# Altium project SuperClock_Core.PrjPcb
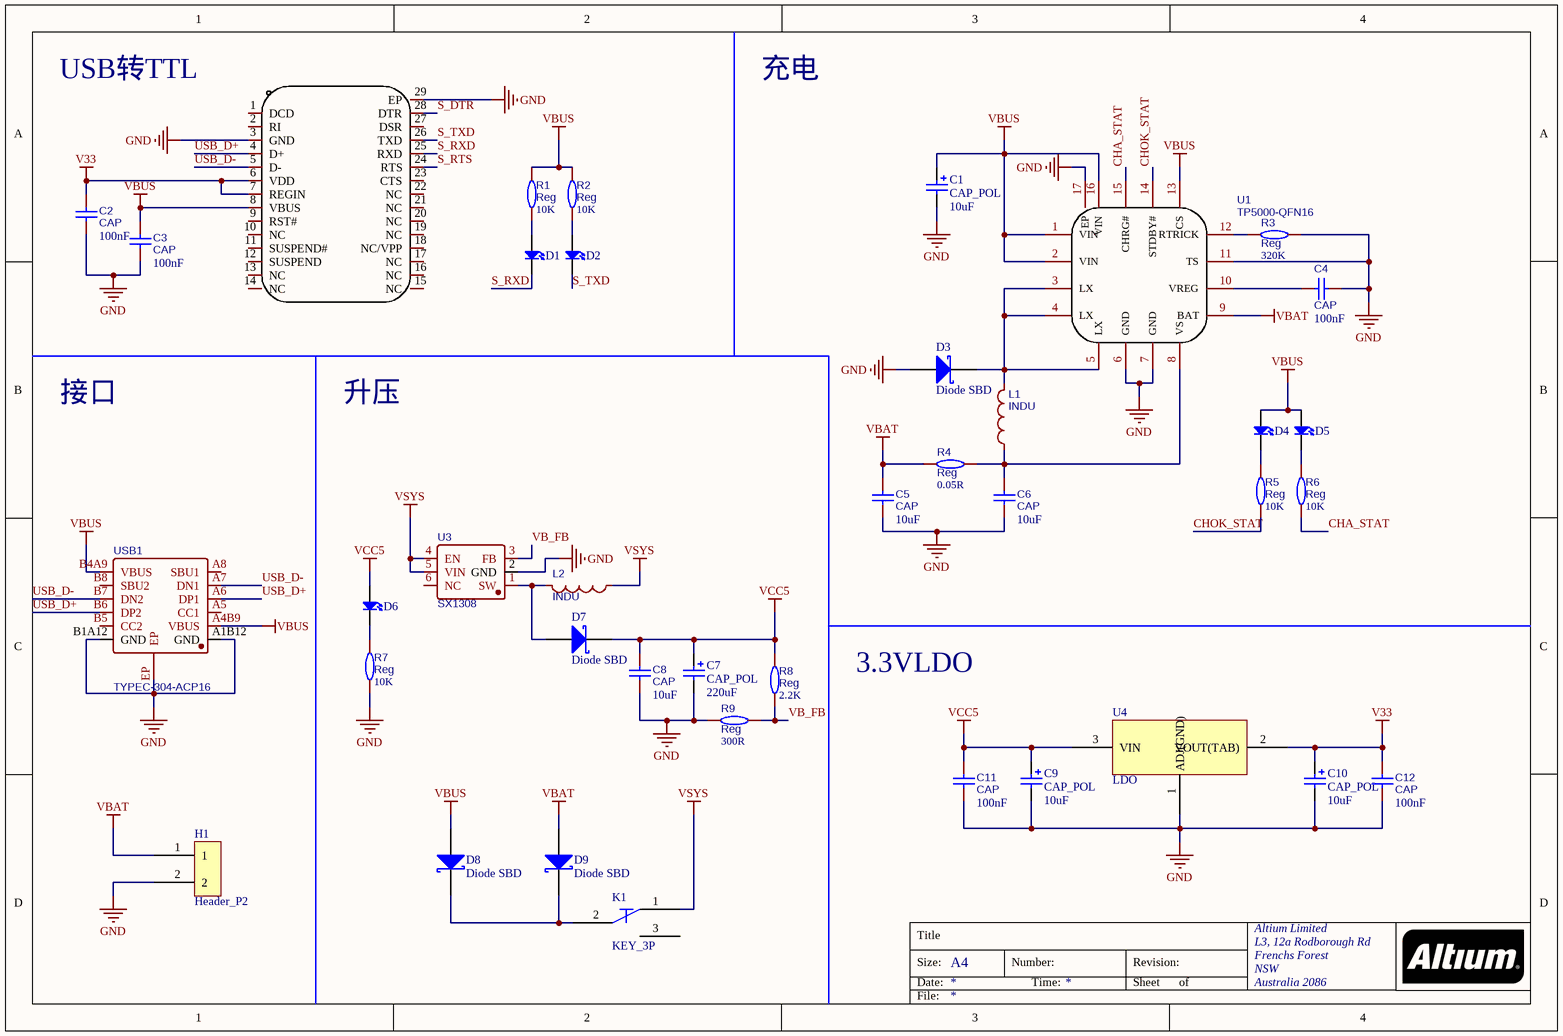
[diagram p0: SuperClock_Core_PWR.SchDoc]
2 sheets, 85 parts. Net scope: global (net labels, ports and power ports of the same name join across sheets).
Board files: SuperClock_Core.PcbDoc, SuperClock_Core_backup.PcbDoc
Sheets:
  SuperClock_Core_PWR.SchDoc
  SuperClock_Core_WIFI.SchDoc

## Sheet SuperClock_Core_PWR.SchDoc
size A4; Organization: Altium Limited; Address1: L3, 12a Rodborough Rd; Address2: Frenchs Forest; Address3: NSW; Address4: Australia 2086

### Parts
C1  CAP_POL  value 10uF  [CP1210]
C2  CAP  value 100nF  [C0603]
C3  CAP  value 100nF  [C0603]
C4  CAP  value 100nF  [C0603]
C5  CAP  value 10uF  [C0603]
C6  CAP  value 10uF  [C0603]
C7  CAP_POL  value 220uF  [CAP_SMD_6.3mm]
C8  CAP  value 10uF  [C0603]
C9  CAP_POL  value 10uF  [CP1210]
C10  CAP_POL  value 10uF  [CP1210]
C11  CAP  value 100nF  [C0603]
C12  CAP  value 100nF  [C0603]
D1  LED  [LED0603]  (value not drawn)
D2  LED  [LED0603]  (value not drawn)
D3  Diode SBD  [SMA_L4.3]
D4  LED  [LED0603]  (value not drawn)
D5  LED  [LED0603]  (value not drawn)
D6  LED  [LED0603]  (value not drawn)
D7  Diode SBD  [SMA_L4.3]
D8  Diode SBD  [SMA_L4.3]
D9  Diode SBD  [SMA_L4.3]
H1  Header_P2  [PH_2Pin]
K1  KEY_3P  [SWITCH_3P_2]
L1  INDU  [SMD_L7.1]
L2  INDU  [SMD_L7.1]
R1  Reg  value 10K  [R0603]
R2  Reg  value 10K  [R0603]
R3  Reg  value 320K  [R0603]
R4  Reg  value 0.05R  [R1206]
R5  Reg  value 10K  [R0603]
R6  Reg  value 10K  [R0603]
R7  Reg  value 10K  [R0603]
R8  Reg  value 2.2K  [R0603]
R9  Reg  value 300R  [R0603]
U1  TP5000-QFN16  [QFN-16_L4.0-W4.0-P0.65-BL-EP2.2]
U2  CP2102-GM  [QFN-28]  (value not drawn)
U3  SX1308  [SOT-23-6]
U4  LDO  [SOT-223]
USB1  TYPEC-304-ACP16  [USB-C-SMD_TYPE-C-16P]

### Nets
GND: C1.2 C2.2 C3.2 C4.2 C5.2 C6.2 C7.2 C8.2 C9.2 C10.2 C11.2 C12.2 D3.2(A) H1.2 R3.2 R7.1 R9.2 U1.6(GND) U1.7(GND) U1.11(TS) U1.17(EP) U2.3(GND) U2.29(EP) U3.2(GND) U4.1(ADJ(GND)) USB1.A1B12(GND) USB1.B1A12(GND) USB1.EP
V33: C2.1 C10.1 C12.1 U2.6(VDD) U2.7(REGIN) U4.2(VOUT(TAB))
VBAT: C5.1 D9.2(A) H1.1 R4.1 U1.9(BAT)
VBUS: C1.1 C3.1 D4.2(A) D5.2(A) D8.2(A) R1.2 R2.2 U1.1(VIN) U1.2(VIN) U1.13(CS) U1.16(VIN) U2.8(VBUS) USB1.A4B9(VBUS) USB1.B4A9(VBUS)
VCC5: C7.1 C8.1 C9.1 C11.1 D6.2(A) D7.1(K) R8.2 U4.3(VIN)
VSYS: K1.1 L2.1 U3.4(EN) U3.5(VIN)
CHA_STAT: R6.1 U1.15(CHRG#)
CHOK_STAT: R5.1 U1.14(STDBY#)
S_DTR: U2.28(DTR)
S_RTS: U2.24(RTS)
S_RXD: D1.1(K) U2.25(RXD)
S_TXD: D2.1(K) U2.26(TXD)
USB_D+: U2.4(D+) USB1.A6(DP1) USB1.B6(DP2)
USB_D-: U2.5(D-) USB1.A7(DN1) USB1.B7(DN2)
VB_FB: R8.1 R9.1 U3.3(FB)
NetC4_1: C4.1 U1.10(VREG)
NetC6_1: C6.1 L1.1 R4.2 U1.8(VS)
NetD1_2: D1.2(A) R1.1
NetD2_2: D2.2(A) R2.1
NetD3_1: D3.1(K) L1.2 U1.3(LX) U1.4(LX) U1.5(LX)
NetD4_1: D4.1(K) R5.2
NetD5_1: D5.1(K) R6.2
NetD6_1: D6.1(K) R7.2
NetD7_2: D7.2(A) L2.2 U3.1(SW)
NetD8_1: D8.1(K) D9.1(K) K1.2
NetR3_1: R3.1 U1.12(RTRICK)

Not connected (* = marked no-connect by the designer): K1 3; U2 1(DCD) 2(RI) 9(RST#) 10(NC) 11(SUSPEND#) 12(SUSPEND) 13(NC) 14(NC) 15(NC) 16(NC) 17(NC) 18(NC/VPP) 19(NC) 20(NC) 21(NC) 22(NC) 23(CTS) 27(DSR); U3 6(NC); USB1 A5(CC1) A8(SBU1) B5(CC2) B8(SBU2)

### Notes on the sheet
- USB转TTL
- 充电
- 接口
- 升压
- 3.3VLDO
- Title
- Size:
- Date:
- A4
- Number:
- Time:
- Revision:
- Sheet
- of
- File:

### Library data of the parts
C1 C7 C9 C10 = CAP_POL: 极性电容
C2-C6 C8 C11 C12 = CAP: BOM_Manufacturer: Huaxin S&T; BOM_Manufacturer Part: 0603B103K101CT; nameAlias: Capacitance; Contributor: LCSC; BOM_Supplier: LCSC; BOM_Supplier Part: C302008; spicePre: C; spiceSymbolName: 0603B103K101CT
D1 D2 D4-D6 = LED0: Published: 8-Jun-2000; LatestRevisionDate: 08-Jul-2005; LatestRevisionNote: Mech Layer 1 removed.; PackageReference: LED-0; Publisher: Altium Limited; PackageDescription: LED; 2 Leads
D3 D7-D9 = Diode SBD: Schottky Rectifier; Note: Terminal 2 is the TAB and is electrically connected to the cathode; Published: 8-Jun-2000; LatestRevisionDate: 17-Jul-2002; LatestRevisionNote: Re-released for DXP Platform.; DatasheetVersion: PD-2.057B; PackageVersion: Feb-1998; PackageReference: TO-220AC; Publisher: Altium Limited; PackageDescription: TO, Thru-Hole, Vertical, Heatsink Mounted; 3 In-Line Leads (1 Absent); Pitch 2.54 mm; ComponentLink1Description: Manufacturer Link; ComponentLink1URL: http://www.irf.com/; ComponentLink2Description: Datasheet; ComponentLink2URL: http://www.irf.com/product-info/datasheets/data/10tq.pdf
H1 = Header_P2: 2Pin排针
K1 = KEY_3P: 3Pin按键
L1 L2 = IND: 电感; BOM_Manufacturer: Sunltech Tech; BOM_Manufacturer Part: SLO0630H150MTT; nameAlias: Inductance; Contributor: LCSC; BOM_Supplier: LCSC; BOM_Supplier Part: C182182; BOM_JLCPCB Part Class: Extended Part; spicePre: L; spiceSymbolName: SLO0630H150MTT; Value: *
R1-R9 = Res: 电阻; BOM_Manufacturer: Viking Tech; BOM_Manufacturer Part: AR03BTCX1002A; nameAlias: Resistance (Ohms); Contributor: LCSC; BOM_Supplier: LCSC; BOM_Supplier Part: C465721; spicePre: R; spiceSymbolName: AR03BTCX1002A
U1 = TP5000-QFN16: BOM_Manufacturer: TOPPOWER; BOM_Supplier: LCSC; BOM_Manufacturer Part: TP5000-QFN16; BOM_Supplier Part: C51699; BOM_JLCPCB Part Class: Extended Part; spicePre: U; spiceSymbolName: TP5000-QFN16
U2 = CP2102-GM: CP2102USB转串口; Manufacturer: SILICON LABS(芯科); Add into BOM: yes; Name: CP2102-GM; Symbol: CP2102-GM; Device: CP2102-GM; LCSC Part Name: Silicon Labs-MCU; Supplier Part: C430012; Manufacturer Part: CP2102-GM; Supplier Footprint: QFN-28; JLCPCB Part Class: Extended Part; Datasheet: https://atta.szlcsc.com/upload/public/pdf/source/20190920/C430012_1BEF61EC258E8DA8CB0C9799CDAE6C98.pdf; Supplier: LCSC; Convert to PCB: yes; Type: -; Protocol: -; Number of Drivers/Receivers: -; Data Rate: -; Supply Voltage: -
U3 = SX1308: 升压PWM; BOM_Manufacturer: SX; sourceId: g4Yg9rJ1j; timeStamp: 1472247539; BOM_Supplier: LCSC; BOM_Manufacturer Part: SX1308; BOM_Supplier Part: C78162; BOM_JLCPCB Part Class: Extended Part; spicePre: U; spiceSymbolName: SX1308
U4 = AMS1117
USB1 = USB_TYPEC_12P: 全引脚USB TYPEC母座; BOM_Manufacturer: XUNPU(讯普); Contributor: LCSC; BOM_Supplier: LCSC; BOM_Supplier Part: C2982555; BOM_Manufacturer Part: TYPEC-304-ACP16; BOM_JLCPCB Part Class: Extended Part; spicePre: U; spiceSymbolName: TYPEC-304-ACP16

## Sheet SuperClock_Core_WIFI.SchDoc
size A4; Organization: Altium Limited; Address1: L3, 12a Rodborough Rd; Address2: Frenchs Forest; Address3: NSW; Address4: Australia 2086
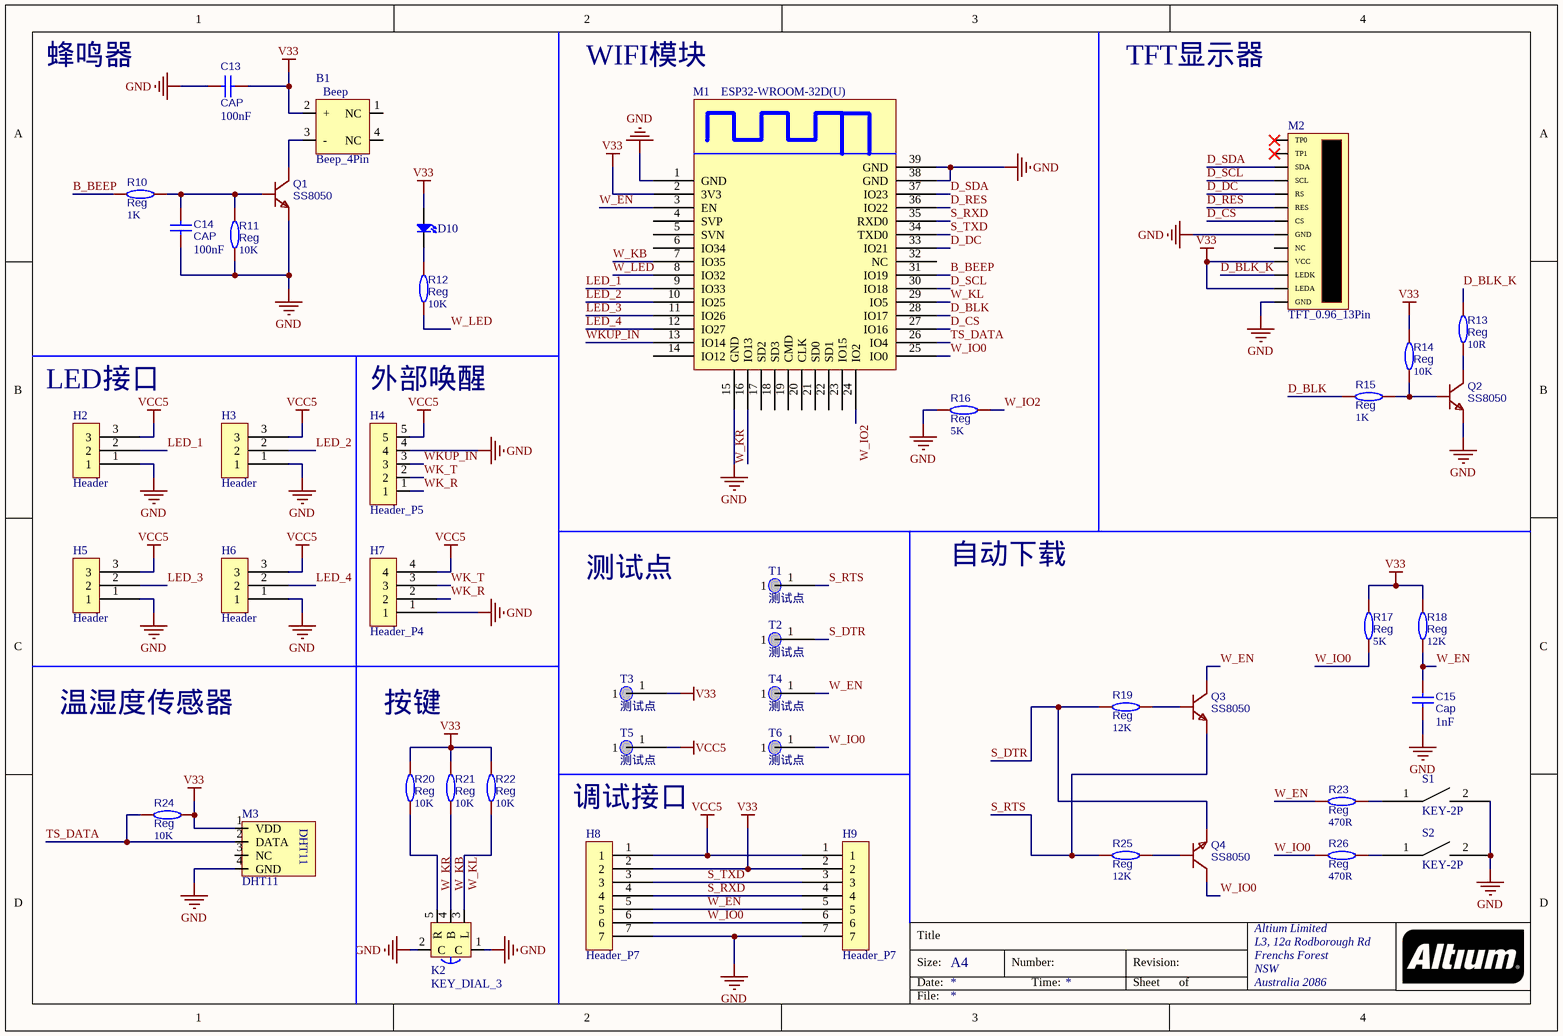
[diagram p1: SuperClock_Core_WIFI.SchDoc]

### Parts
B1  Beep_4Pin  [Beep_4Pin_7525]
C13  CAP  value 100nF  [C0603]
C14  CAP  value 100nF  [C0603]
C15  Cap  value 1nF  [C0603]
D10  LED  [LED0603]  (value not drawn)
H2  Header  [H_2.54_P3]
H3  Header  [H_2.54_P3]
H4  Header_P5  [H_1.27_P5]
H5  Header  [H_2.54_P3]
H6  Header  [H_2.54_P3]
H7  Header_P4  [H_2.54_P4]
H8  Header_P7  [H_2.54_P7]
H9  Header_P7  [H_2.54_P7]
K2  KEY_DIAL_3  [KEY_DIAL_3]
M1  ESP32-WROOM-32D(U)  [ESP32-WROOM-32D]
M2  TFT_0.96_13Pin  [TFT_0.96_13Pin]
M3  DHT11  [SENSOR-TH_DHT11-HOR]
Q1  SS8050  [SOT-23-3]
Q2  SS8050  [SOT-23-3]
Q3  SS8050  [SOT-23-3]
Q4  SS8050  [SOT-23-3]
R10  Reg  value 1K  [R0603]
R11  Reg  value 10K  [R0603]
R12  Reg  value 10K  [R0603]
R13  Reg  value 10R  [R0603]
R14  Reg  value 10K  [R0603]
R15  Reg  value 1K  [R0603]
R16  Reg  value 5K  [R0603]
R17  Reg  value 5K  [R0603]
R18  Reg  value 12K  [R0603]
R19  Reg  value 12K  [R0603]
R20  Reg  value 10K  [R0603]
R21  Reg  value 10K  [R0603]
R22  Reg  value 10K  [R0603]
R23  Reg  value 470R  [R0603]
R24  Reg  value 10K  [R0603]
R25  Reg  value 12K  [R0603]
R26  Reg  value 470R  [R0603]
S1  KEY-2P  [KEY_SOT_P2]
S2  KEY-2P  [KEY_SOT_P2]
T1  测试点  [TEST_POINT]
T2  测试点  [TEST_POINT]
T3  测试点  [TEST_POINT]
T4  测试点  [TEST_POINT]
T5  测试点  [TEST_POINT]
T6  测试点  [TEST_POINT]

### Nets
GND: C13.1 C14.2 C15.2 H2.1 H3.1 H4.4 H5.1 H6.1 H7.1 H8.7 H9.7 K2.1(C) K2.2(C) M1.1(GND) M1.15(GND) M1.38(GND) M1.39(GND) M2.8(GND) M2.13(GND) M3.4(GND) Q1.2(E) Q2.2(E) R11.2 R16.2 S1.2 S2.2
V33: B1.2(+) C13.2 D10.2(A) H8.2 H9.2 M1.2(3V3) M2.10(VCC) M2.12(LEDA) M3.1(VDD) R14.2 R17.2 R18.2 R20.1 R21.1 R22.1 R24.1 T3.1
VCC5: H2.3 H3.3 H4.5 H5.3 H6.3 H7.4 H8.1 H9.1 T5.1
B_BEEP: M1.31(IO19) R10.2
D_BLK: M1.28(IO17) R15.2
D_BLK_K: M2.11(LEDK) R13.2
D_CS: M1.27(IO16) M2.7(CS)
D_DC: M1.33(IO21) M2.5(RS)
D_RES: M1.36(IO22) M2.6(RES)
D_SCL: M1.30(IO18) M2.4(SCL)
D_SDA: M1.37(IO23) M2.3(SDA)
LED_1: H2.2 M1.9(IO33)
LED_2: H3.2 M1.10(IO25)
LED_3: H5.2 M1.11(IO26)
LED_4: H6.2 M1.12(IO27)
S_DTR: Q4.2(E) R19.2 T2.1
S_RTS: Q3.2(E) R25.2 T1.1
S_RXD: H8.4 H9.4 M1.35(RXD0)
S_TXD: H8.3 H9.3 M1.34(TXD0)
TS_DATA: M1.26(IO4) M3.2(DATA) R24.2
W_EN: C15.1 H8.5 H9.5 M1.3(EN) Q3.3(C) R18.1 R23.2 T4.1
W_IO0: H8.6 H9.6 M1.25(IO0) Q4.3(C) R17.1 R26.2 T6.1
W_IO2: M1.24(IO2) R16.1
W_KB: K2.4(B) M1.7(IO35) R21.2
W_KL: K2.3(L) M1.29(IO5) R22.2
W_KR: K2.5(R) M1.16(IO13) R20.2
W_LED: M1.8(IO32) R12.1
WK_R: H4.1 H7.2
WK_T: H4.2 H7.3
WKUP_IN: H4.3 M1.13(IO14)
NetB1_3: B1.3(-) Q1.3(C)
NetC14_1: C14.1 Q1.1(B) R10.1 R11.1
NetD10_1: D10.1(K) R12.2
NetQ2_1: Q2.1(B) R14.1 R15.1
NetQ2_3: Q2.3(C) R13.1
NetQ3_1: Q3.1(B) R19.1
NetQ4_1: Q4.1(B) R25.1
NetR23_1: R23.1 S1.1
NetR26_1: R26.1 S2.1

Not connected (* = marked no-connect by the designer): B1 1(NC) 4(NC); M1 4(SVP) 5(SVN) 6(IO34) 14(IO12) 17(SD2) 18(SD3) 19(CMD) 20(CLK) 21(SD0) 22(SD1) 23(IO15) 32(NC); M2 1(TP0)* 2(TP1)* 9(NC); M3 3(NC)

### Notes on the sheet
- 蜂鸣器
- WIFI模块
- TFT显示器
- (near H2) LED接口
- 外部唤醒
- 测试点
- 自动下载
- 温湿度传感器
- 按键
- 调试接口
- Title
- Size:
- Date:
- A4
- Number:
- Time:
- Revision:
- Sheet
- of
- File:
- (in symbol Beep_4Pin) Beep

### Library data of the parts
B1 = Beep_4Pin: 4Pin蜂鸣器
C13-C15 = CAP: as C2 on sheet SuperClock_Core_PWR; BOM_Supplier: LCSC; BOM_Supplier Part: C302008; spicePre: C; spiceSymbolName: 0603B103K101CT
D10 = LED0: Published: 8-Jun-2000; LatestRevisionDate: 08-Jul-2005; LatestRevisionNote: Mech Layer 1 removed.; PackageReference: LED-0; Publisher: Altium Limited; PackageDescription: LED; 2 Leads
H2 H3 H5 H6 = Header_P3: 3Pin接口
H4 = Header_P5: 5Pin排针
H7 = Header_P4: 4Pin排针
H8 H9 = Header_P7: 7Pin排针
K2 = KEY_DIAL_3: 3向拨轮开关
M2 = TFT_0.96_13Pin: ST7735_TFT
M3 = DHT11: 温湿度传感器
Q1-Q4 = SS8050: NPN; BOM_Manufacturer: AnBon; Contributor: LCSC; BOM_Paste Type: recommend; BOM_Supplier: LCSC; BOM_Supplier Part: C541705; BOM_Manufacturer Part: SS8050; spicePre: Q; spiceSymbolName: SS8050_C541705
R10-R26 = Res: as R1 on sheet SuperClock_Core_PWR; BOM_Supplier: LCSC; BOM_Supplier Part: C465721; spicePre: R; spiceSymbolName: AR03BTCX1002A
S1 S2 = KEY_2P: KEY-2Pp
T1-T6 = TEST_POINT

## Nets that join several sheets
GND: SuperClock_Core_PWR (28 pins), SuperClock_Core_WIFI (26 pins)
V33: SuperClock_Core_PWR (6 pins), SuperClock_Core_WIFI (17 pins)
VCC5: SuperClock_Core_PWR (8 pins), SuperClock_Core_WIFI (9 pins)
S_DTR: SuperClock_Core_PWR (U2.28), SuperClock_Core_WIFI (Q4.2 R19.2 T2.1)
S_RTS: SuperClock_Core_PWR (U2.24), SuperClock_Core_WIFI (Q3.2 R25.2 T1.1)
S_RXD: SuperClock_Core_PWR (D1.1 U2.25), SuperClock_Core_WIFI (H8.4 H9.4 M1.35)
S_TXD: SuperClock_Core_PWR (D2.1 U2.26), SuperClock_Core_WIFI (H8.3 H9.3 M1.34)